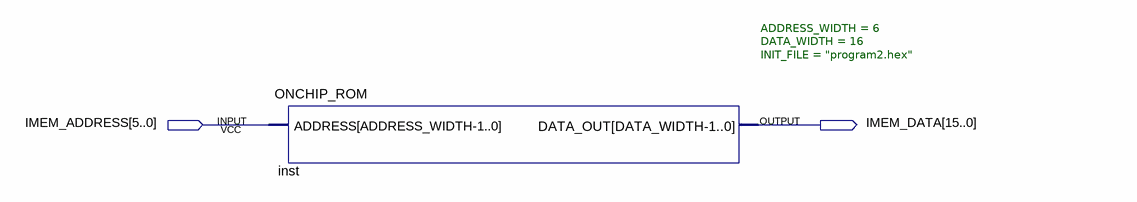
[diagram p0: schematic sheet]
// Quartus schematic ONCHIP_ROM_Test.bdf as structural Verilog: 1 symbols, 2 pins
module ONCHIP_ROM_Test (
  input  [5:0] IMEM_ADDRESS,
  output [15:0] IMEM_DATA
);

  ONCHIP_ROM #(.ADDRESS_WIDTH(6), .DATA_WIDTH(16), .INIT_FILE("program2.hex")) inst (
    .ADDRESS(IMEM_ADDRESS), .DATA_OUT(IMEM_DATA));
endmodule
